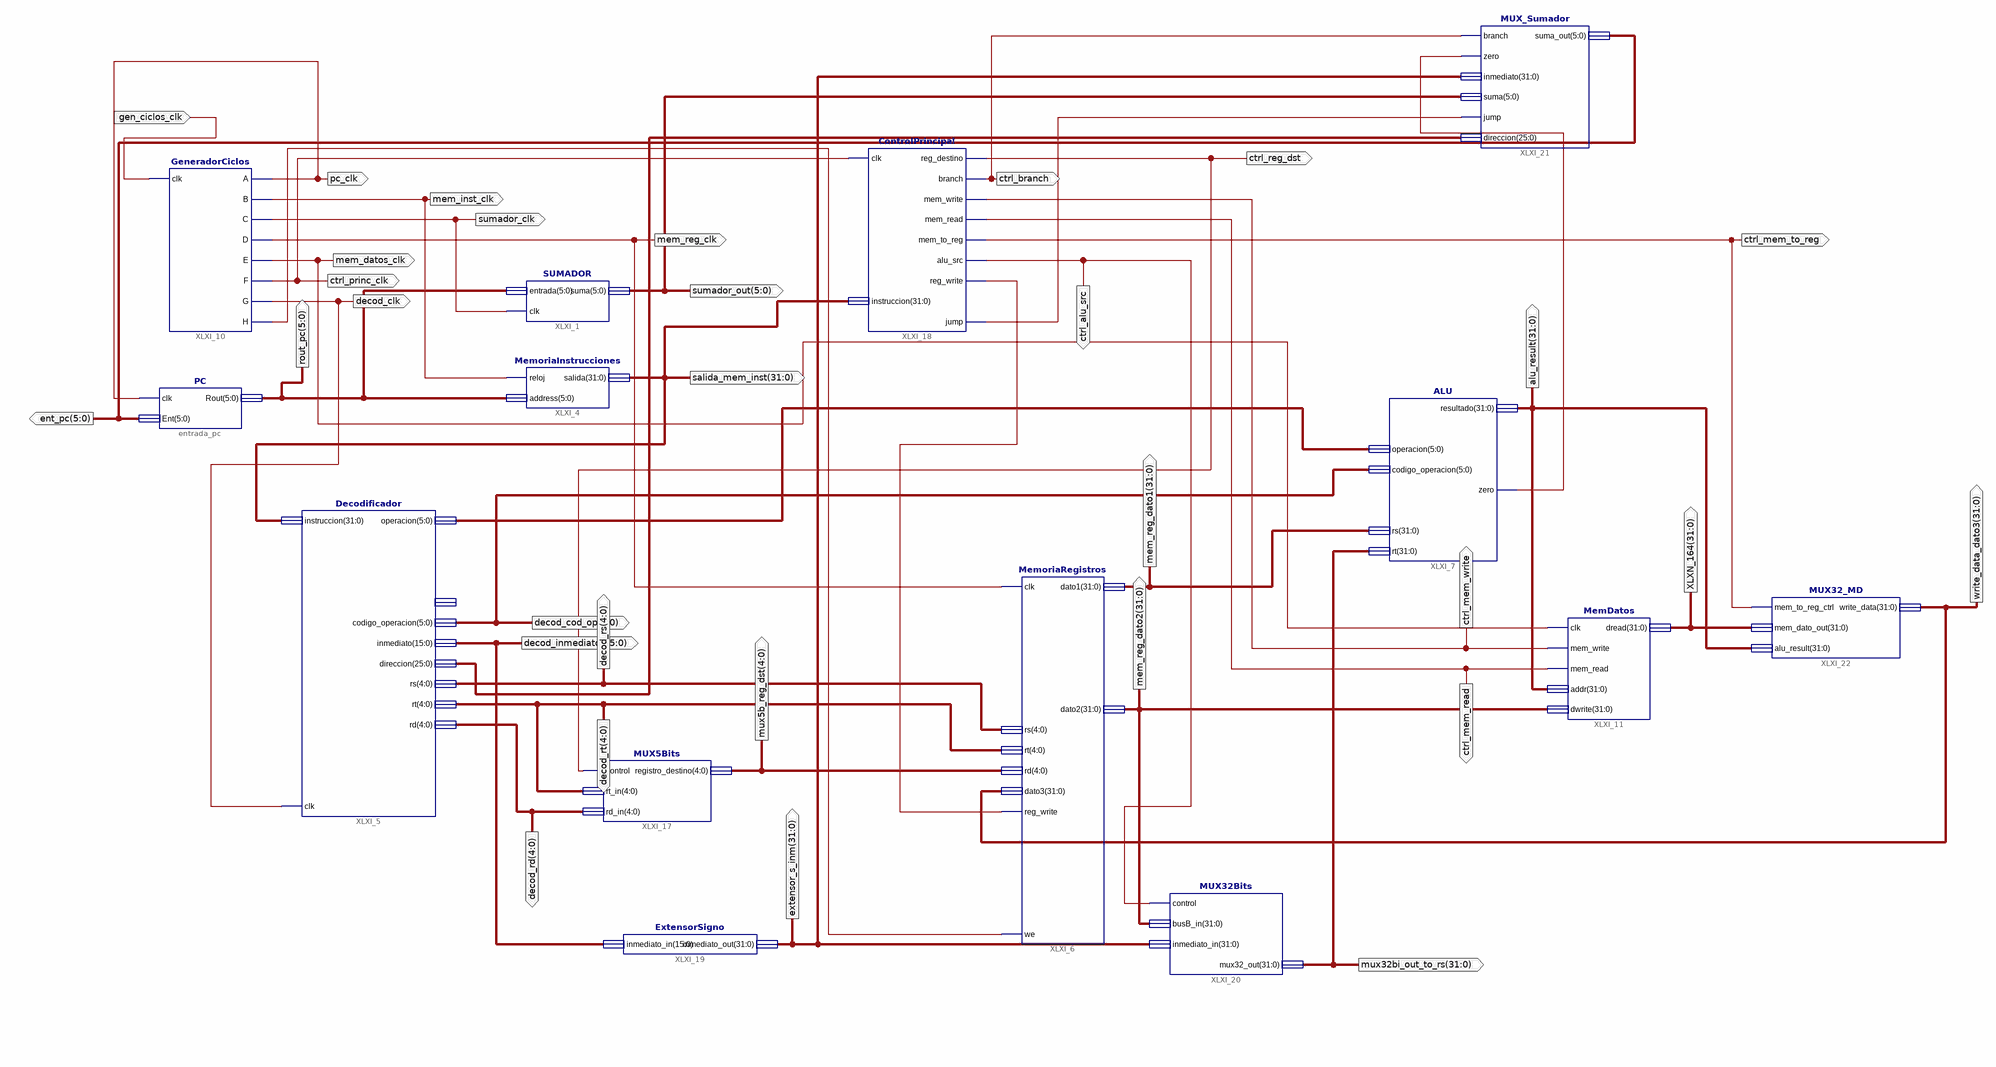
[diagram p0: schematic sheet 1]
// Xilinx ISE schematic Camino.sch (spartan6) as structural Verilog: 14 symbols, 31 ports
module Camino (
  input  gen_ciclos_clk,
  output [5:0] rout_pc,
  output pc_clk,
  output mem_inst_clk,
  output sumador_clk,
  output [31:0] mem_reg_dato1,
  output [4:0] decod_rs,
  output [4:0] decod_rt,
  output [4:0] decod_rd,
  output [4:0] mux5b_reg_dst,
  output ctrl_reg_dst,
  output [15:0] decod_inmediato,
  output [31:0] extensor_s_inm,
  output ctrl_branch,
  output [5:0] decod_cod_op,
  output [5:0] sumador_out,
  output ctrl_alu_src,
  output mem_reg_clk,
  output [31:0] mem_reg_dato2,
  output [31:0] alu_result,
  output [31:0] XLXN_164,
  output [31:0] write_data_dato3,
  output ctrl_mem_to_reg,
  output ctrl_mem_write,
  output ctrl_mem_read,
  output mem_datos_clk,
  output ctrl_princ_clk,
  output [31:0] salida_mem_inst,
  output decod_clk,
  output [5:0] ent_pc,
  output [31:0] mux32bi_out_to_rs
);

  wire XLXN_154, XLXN_157, XLXN_175, XLXN_176;
  wire [5:0] XLXN_174;
  wire [25:0] XLXN_177;

  PC entrada_pc (.clk(pc_clk), .Ent(ent_pc), .Rout(rout_pc));
  MemoriaInstrucciones XLXI_4 (.reloj(mem_inst_clk), .address(rout_pc), .salida(salida_mem_inst));
  SUMADOR XLXI_1 (.entrada(rout_pc), .suma(sumador_out), .clk(sumador_clk));
  Decodificador XLXI_5 (
    .clk(decod_clk), .instruccion(salida_mem_inst), .operacion(XLXN_174), .rs(decod_rs), .rt(decod_rt),
    .rd(decod_rd), .inmediato(decod_inmediato), .direccion(XLXN_177), .codigo_operacion(decod_cod_op));  // open: shamt
  MemoriaRegistros XLXI_6 (
    .clk(mem_reg_clk), .reg_write(XLXN_154), .rs(decod_rs), .rt(decod_rt), .rd(mux5b_reg_dst),
    .dato3(write_data_dato3), .dato1(mem_reg_dato1), .dato2(mem_reg_dato2), .we(XLXN_175));
  ALU XLXI_7 (
    .rs(mem_reg_dato1), .rt(mux32bi_out_to_rs), .codigo_operacion(decod_cod_op), .operacion(XLXN_174),
    .zero(XLXN_157), .resultado(alu_result));
  GeneradorCiclos XLXI_10 (
    .clk(gen_ciclos_clk), .A(pc_clk), .B(mem_inst_clk), .C(sumador_clk), .D(mem_reg_clk), .E(mem_datos_clk),
    .F(ctrl_princ_clk), .G(decod_clk), .H(XLXN_175));
  MemDatos XLXI_11 (
    .clk(mem_datos_clk), .mem_write(ctrl_mem_write), .mem_read(ctrl_mem_read), .addr(alu_result),
    .dwrite(mem_reg_dato2), .dread(XLXN_164));
  MUX5Bits XLXI_17 (.control(ctrl_reg_dst), .rt_in(decod_rt), .rd_in(decod_rd), .registro_destino(mux5b_reg_dst));
  ControlPrincipal XLXI_18 (
    .clk(ctrl_princ_clk), .instruccion(salida_mem_inst), .reg_destino(ctrl_reg_dst), .branch(ctrl_branch),
    .mem_write(ctrl_mem_write), .mem_read(ctrl_mem_read), .mem_to_reg(ctrl_mem_to_reg), .reg_write(XLXN_154),
    .alu_src(ctrl_alu_src), .jump(XLXN_176));
  ExtensorSigno XLXI_19 (.inmediato_in(decod_inmediato), .inmediato_out(extensor_s_inm));
  MUX32Bits XLXI_20 (
    .control(ctrl_alu_src), .busB_in(mem_reg_dato2), .inmediato_in(extensor_s_inm),
    .mux32_out(mux32bi_out_to_rs));
  MUX_Sumador XLXI_21 (
    .branch(ctrl_branch), .zero(XLXN_157), .jump(XLXN_176), .inmediato(extensor_s_inm), .direccion(XLXN_177),
    .suma(sumador_out), .suma_out(ent_pc));
  MUX32_MD XLXI_22 (
    .mem_to_reg_ctrl(ctrl_mem_to_reg), .mem_dato_out(XLXN_164), .alu_result(alu_result),
    .write_data(write_data_dato3));
endmodule
